# Altium schematic sheet AUDIO_REV2.SchDoc
size A4; SheetNumber: 5; SheetTotal: 11
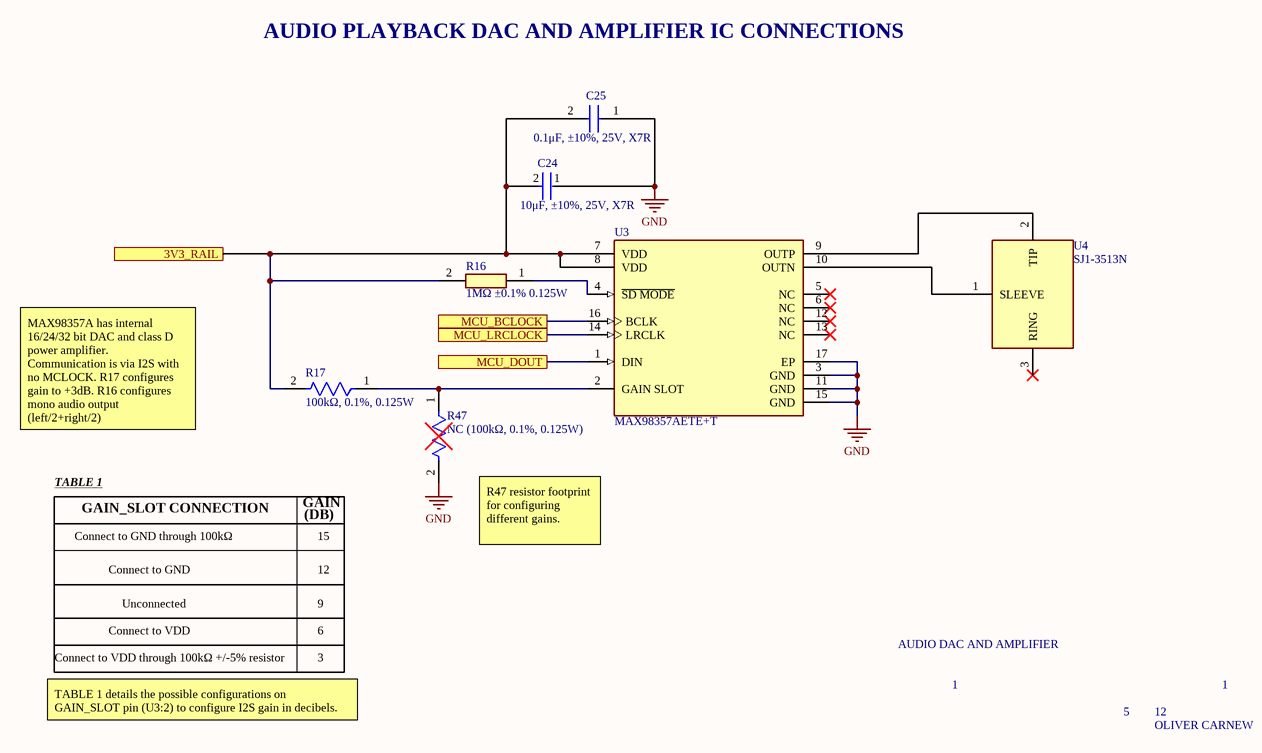
[diagram p0: AUDIO_REV2.SchDoc]

## Parts
*  NC  (value not drawn)
C24  10μF, ±10%, 25V, X7R  [FP-CL21B106KOQNNNE-MFG]
C25  0.1μF, ±10%, 25V, X7R  [CAPC1005X55N]
R16  1MΩ ±0.1% 0.125W  [RESC2012X50N]
R17  100kΩ, 0.1%, 0.125W  [FP-RG2012-IPC_B]
R47  NC (100kΩ, 0.1%, 0.125W)  [FP-RG2012-IPC_B]
U3  MAX98357AETE+T  [FP-T1633-4-IPC_B]
U4  SJ1-3513N  [SJ13513N - stubby silk]

## Ports
3V3_RAIL, MCU_BCLOCK, MCU_DOUT, MCU_LRCLOCK

## Nets
GND: C24.1 C25.1 R47.2 U3.3(GND) U3.11(GND) U3.15(GND) U3.17(EP)
3V3_RAIL: C24.2 C25.2 R16.2 R17.2 U3.7(VDD) U3.8(VDD) ; port 3V3_RAIL
MCU_BCLOCK: U3.16(BCLK) ; port MCU_BCLOCK
MCU_DOUT: U3.1(DIN) ; port MCU_DOUT
MCU_LRCLOCK: U3.14(LRCLK) ; port MCU_LRCLOCK
NetR16_1: R16.1 U3.4(~{SD_MODE})
NetR17_1: R17.1 R47.1 U3.2(GAIN_SLOT)
NetU3_9: U3.9(OUTP) U4.2(TIP)
NetU3_10: U3.10(OUTN) U4.1(SLEEVE)

Not connected (* = marked no-connect by the designer): U3 5(NC)* 6(NC)* 12(NC)* 13(NC)*; U4 3(RING)*

## Notes on the sheet
- AUDIO PLAYBACK DAC AND AMPLIFIER IC CONNECTIONS
- MAX98357A has internal 16/24/32 bit DAC and class D power amplifier. Communication is via I2S with no MCLOCK. R17 configures gain to +3dB. R16 configures mono audio output (left/2+right/2)
- TABLE 1
- GAIN_SLOT CONNECTION
- GAIN
- (DB)
- Connect to GND through 100kΩ
- Connect to GND
- 15
- 12
- R47 resistor footprint for configuring different gains.
- Connect to VDD
- Unconnected
- 9
- 6
- AUDIO DAC AND AMPLIFIER
- TABLE 1 details the possible configurations on GAIN_SLOT pin (U3:2) to configure I2S gain in decibels.
- Connect to VDD through 100kΩ +/-5% resistor
- 3
- 1
- 5
- OLIVER CARNEW

## Library data of the parts
C24 = CMP-2000-06106-2: CAP CER 10UF 16V X7R 0805 CL21B106KOQNNNE; Manufacturer: Samsung Electro-Mechanics America, Inc; Material: Ceramic; Temperature Coefficient: 15%; Digikey Description: CAP CER 10UF 16V X7R 0805; Lead Free: Yes; ComponentLink2URL: http://www.samsungsem.com/servlet/FileDownload?path=productsearch&sname=CL21B106KOQNNNE.pdf&oname=CL21B106KOQNNNE.pdf; ComponentLink2Description: Datasheet; Temperature Range Low: -55°C; RoHS: TRUE; Category: Cap; Temperature Characteristic: X7R; Manufacturer Part Number: CL21B106KOQNNNE; Automotive: No; Octopart: https://octopart.com/cl21b106koqnnne-samsung-19832289; Device Class L3: Ceramic Capacitors; Temperature Range High: +125°C; Height: 1.4mm; Device Class L2: Capacitors; Voltage Rating: 16V; Value: 10uF; Temperature: -55°C to +125°C; Tolerance: 10%; Device Class L1: Passive Components; Ipc Land Pattern Name: CAPC200125X125; Package: CL21B106KOQNNNE; Capacitance: 10uF
C25 = CL05B104KA5NNNC: Capacitor CAP CER 0.1UF 25V X7R 0402 CL05B104KA5NNNC 0402; Manufacturer_Name: SAMSUNG; Datasheet Link: https://datasheet.datasheetarchive.com/originals/distributors/DKDS-19/372989.pdf; Height: 0.55mm; Manufacturer_Part_Number: CL05B104KA5NNNC; Mouser Part Number: 187-CL05B104KA5NNNC; Mouser Price/Stock: https://www.mouser.co.uk/ProductDetail/Samsung-Electro-Mechanics/CL05B104KA5NNNC?qs=Efv9o2T6U88DLyyMSzjXSQ%3D%3D; Arrow Part Number: CL05B104KA5NNNC; Arrow Price/Stock: https://www.arrow.com/en/products/cl05b104ka5nnnc/samsung-electro-mechanics?region=nac; Parameter 1: Capacitor CAP CER 0.1UF 25V X7R 0402 CL05B104KA5NNNC
R16 = RG2012P-105-B-T5: 1 MOhms ±0.1% 0.125W, 1/8W Chip Resistor 0805 (2012 Metric) Anti-Sulfur, Automotive AEC-Q200 Thin Film; Manufacturer_Name: Susumu; Datasheet Link: https://componentsearchengine.com/Datasheets/1/RG2012P-105-B-T5.pdf; Height: 0.5mm; Manufacturer_Part_Number: RG2012P-105-B-T5; Mouser Part Number: 754-RG2012P-105-B-T5; Mouser Price/Stock: https://www.mouser.co.uk/ProductDetail/Susumu/RG2012P-105-B-T5?qs=juJhw1yPxAGByirLlL9gEQ%3D%3D; Arrow Part Number: RG2012P-105-B-T5; Arrow Price/Stock: https://www.arrow.com/en/products/rg2012p-105-b-t5/susumu?region=europe
R17 R47 = CMP-2001-02710-2: RG2012P-104-B-T5Automotive Metal Thin Film Chip Resistor, 0805, 100kΩ, 0.1%, 25ppm/°C, 0.125W, 150V; Power Rating: 125mW; Resistance: 100kR; Parameter 1: 100 kOhms ±0.1% 0.125W, 1/8W Chip Resistor 0805 (2012 Metric) Anti-Sulfur, Automotive AEC-Q200 Thin Film; Voltage Rating (DC): 150V; Tolerance: 0.1%; Lead Free: Lead Free; Features: Automotive AEC-Q200; Weight: 0.000194oz; Min Operating Temperature: -55°C; Number of Terminations: 2; Case Code (Metric): 2012; Width: 1.2mm; Max Power Dissipation: 125mW; Voltage Rating: 150V; RoHS Compliant: Yes; Length: 2mm; Series: RG; Resistor Type: Thin Film; Termination: SMD/SMT; Max Operating Temperature: 155°C; Case/Package: 0805; Temperature Coefficient: 25ppm/°C; Packaging: Tape and Reel; Case Code (Imperial): 0805; Height: 0.4mm; Size Code: 0805
U3 = CMP-05698-000018-1: IC AMP CLASS D MONO 3.2W 16TQFN; Max Supply Voltage: 5.5V; Max Output Current: 1.6A; Voltage Gain: 15dB; Max Power Dissipation: 1.666W; Min Supply Voltage: 2.5V; Power Supply Rejection Ratio (PSRR): 77dB; Series: -; Contact Plating: Tin; Min Operating Temperature: -40°C; Packaging: Tape and Reel; Max Output Power: 3.2W; Mount: Surface Mount; Number of Pins: 16; RoHS Compliant: Yes; Max Operating Temperature: 85°C; Radiation Hardening: No
U4 = SJ1-3513N: Undefined or Miscellaneous; Manufacturer_Name: Same Sky; Datasheet Link: https://www.sameskydevices.com/product/resource/sj1-351xn.pdf; Height: 6mm; Manufacturer_Part_Number: SJ1-3513N; Mouser Part Number: 490-SJ1-3513N; Mouser Price/Stock: https://www.mouser.co.uk/ProductDetail/Same-Sky/SJ1-3513N?qs=WyjlAZoYn501Uyi9N5Ym3w%3D%3D; Arrow Part Number: SJ1-3513N; Arrow Price/Stock: https://www.arrow.com/en/products/sj1-3513n/cui-devices?region=nac